# Altium schematic sheet Sheet1.schdoc
size A4
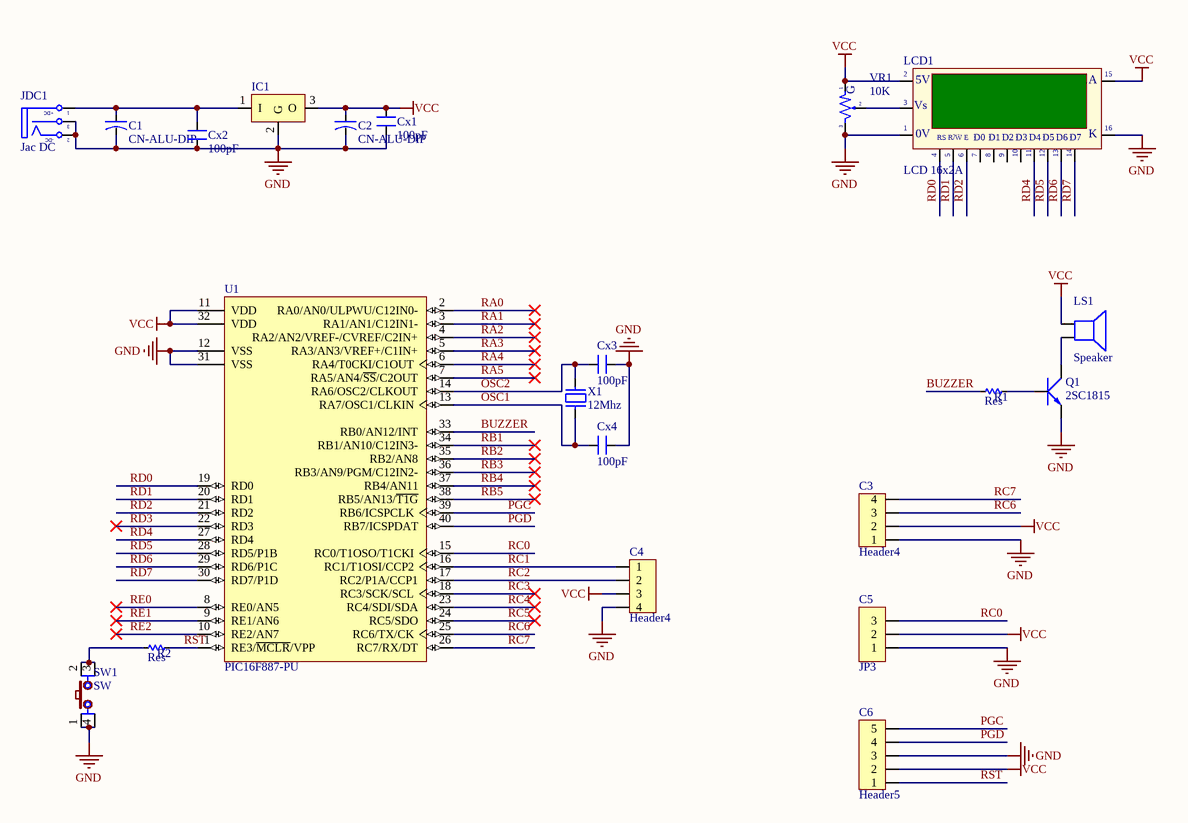
[diagram p0: Sheet1.schdoc]

## Parts
C1  CN-ALU-DIP  [CA-ALU-10BL]
C2  CN-ALU-DIP  [CA-ALU-10BL]
C3  Header4  [Header4]
C4  Header4  [Header4]
C5  JP3  [JP3-D1T]
C6  Header5  [Header5]
Cx1  100pF  [CN1.5]
Cx2  100pF  [CN1.5]
Cx3  100pF  [CN2.5]
Cx4  100pF  [CN2.5]
IC1  LM78xx  [TO220-123]  (value not drawn)
JDC1  Jac DC  [DC0]
LCD1  LCD 16x2A  [LCD16X2N]
LS1  Speaker  [SPEAKER]
Q1  2SC1815  [TO92-123]
R1  Res  [RES-1/4W]
R2  Res  [RES-1/4W]
SW1  SW  [SW2-DIP]
U1  PIC16F887-PU  [DIP40/W0.6]
VR1  10K  [VR-S2]
X1  12Mhz  [XT2]

## Nets
GND: C1.2 C2.2 C3.1 C4.4 C5.1 C6.3 Cx1.2 Cx2.2 Cx3.2 Cx4.2 IC1.2(G) JDC1.2(TN) JDC1.3(S) LCD1.1(GND) LCD1.16(K) Q1.1(E) SW1.1 SW1.4 U1.12(VSS) U1.31(VSS) VR1.3
VCC: C2.1 C3.2 C4.3 C5.2 C6.2 Cx1.1 IC1.3(O) LCD1.2(VDD) LCD1.15(A) LS1.1 U1.11(VDD) U1.32(VDD) VR1.1
BUZZER: R1.2 U1.33(RB0/AN12/INT)
OSC1: Cx4.1 U1.13(RA7/OSC1/CLKIN) X1.1
OSC2: Cx3.1 U1.14(RA6/OSC2/CLKOUT) X1.2
PGC: C6.5 U1.39(RB6/ICSPCLK)
PGD: C6.4 U1.40(RB7/ICSPDAT)
RA0: U1.2(RA0/AN0/ULPWU/C12IN0-)
RA1: U1.3(RA1/AN1/C12IN1-)
RA2: U1.4(RA2/AN2/VREF-/CVREF/C2IN+)
RA3: U1.5(RA3/AN3/VREF+/C1IN+)
RA4: U1.6(RA4/T0CKI/C1OUT)
RA5: U1.7(RA5/AN4/~{SS}/C2OUT)
RB1: U1.34(RB1/AN10/C12IN3-)
RB2: U1.35(RB2/AN8)
RB3: U1.36(RB3/AN9/PGM/C12IN2-)
RB4: U1.37(RB4/AN11)
RB5: U1.38(RB5/AN13/~{T1G})
RC0: C5.3 U1.15(RC0/T1OSO/T1CKI)
RC1: C4.1 U1.16(RC1/T1OSI/CCP2)
RC2: C4.2 U1.17(RC2/P1A/CCP1)
RC3: U1.18(RC3/SCK/SCL)
RC4: U1.23(RC4/SDI/SDA)
RC5: U1.24(RC5/SDO)
RC6: C3.3 U1.25(RC6/TX/CK)
RC7: C3.4 U1.26(RC7/RX/DT)
RD0: LCD1.4(RS) U1.19(RD0)
RD1: LCD1.5(R/~{W}) U1.20(RD1)
RD2: LCD1.6(~{EN}) U1.21(RD2)
RD3: U1.22(RD3)
RD4: LCD1.11(D4) U1.27(RD4)
RD5: LCD1.12(D5) U1.28(RD5/P1B)
RD6: LCD1.13(D6) U1.29(RD6/P1C)
RD7: LCD1.14(D7) U1.30(RD7/P1D)
RE0: U1.8(RE0/AN5)
RE1: U1.9(RE1/AN6)
RE2: U1.10(RE2/AN7)
RST: C6.1 R2.1 U1.1(RE3/~{MCLR}/VPP)
NetC1_1: C1.1 Cx2.1 IC1.1(I) JDC1.1(T)
NetLCD1_3: LCD1.3(VEE) VR1.2
NetLS1_2: LS1.2 Q1.2(C)
NetQ1_3: Q1.3(B) R1.1
NetR2_2: R2.2 SW1.2 SW1.3

Not connected (* = marked no-connect by the designer): LCD1 7(D0) 8(D1) 9(D2) 10(D3)

## Notes on the sheet
- (in symbol DCIN) +DC; -DC
- (in symbol LCD16x2A) 5V; Vs; |; 0V; R/W; E
- (in symbol VR-S) G

## Library data of the parts
C1 C2 = CN-ALU-DIP: Capacitor (Semiconductor SIM Model); Value: 104; LatestRevisionDate: 17-Jul-2002; LatestRevisionNote: Re-released for DXP Platform.; PackageReference: C1206; Publisher: Altium Limited
C3 C4 = Header4: Header IDC, 4 x 1 Pin Vertical 2.54mm Pitch (Non-Boxed, Male); Manufacturer: W¨¹rth Elektronik eiSos GmbH; partNo: 613002143121; ComponentLink1 Description: Manufacturer; ComponentLink2 Description: Datasheet; NoPins: 02; Created Date: 29 March 2013; ComponentLink1URL: http://www.we-online.com; ComponentLink2URL: http://katalog.we-online.de/em/datasheet/6130xx143121.pdf; Created by: Karrer Zheng
C5 = JP3: WR-PHD 2.54 mm Angled Socket Header; Manufacturer: W¨¹rth Elektronik eiSos GmbH; partNo: 613003143121; ComponentLink1 Description: Manufacturer; ComponentLink2 Description: Datasheet; NoPins: 03; Created Date: 29 March 2013; ComponentLink1URL: http://www.we-online.com; ComponentLink2URL: http://katalog.we-online.de/em/datasheet/6130xx143121.pdf; Created by: Karrer Zheng
C6 = Header5: Header IDC, 5 x 1 Pin Vertical 2.54mm Pitch (Non-Boxed, Male); Manufacturer: W¨¹rth Elektronik eiSos GmbH; partNo: 613002143121; ComponentLink1 Description: Manufacturer; ComponentLink2 Description: Datasheet; NoPins: 02; Created Date: 29 March 2013; ComponentLink1URL: http://www.we-online.com; ComponentLink2URL: http://katalog.we-online.de/em/datasheet/6130xx143121.pdf; Created by: Karrer Zheng
Cx1-Cx4 = CN: Value: 33pF
IC1 = LM78xx: Positive Voltage Regulator; Note: Tab is connected to pin 3 (GND).; Published: 24-Aug-2001; LatestRevisionDate: 17-Jul-2002; LatestRevisionNote: Re-released for DXP Platform.; DatasheetVersion: Apr-1994; PackageVersion: Jul-1998; PackageReference: ISOWATT220AB; Publisher: Altium Limited; PackageDescription: TO, Thru-Hole, Vertical, Heatsink Mounted; 3 In-Line Leads; Pitch 2.54 mm; Pin sequence 1, 3, 2; ComponentLink1Description: Manufacturer Link; ComponentLink1URL: http://www.st.com/; ComponentLink2Description: Datasheet; ComponentLink2URL: http://www.st.com/stonline/products/literature/ds/2146/l78m05c.pdf
JDC1 = DCIN: Jac DC input; Value: Jac DC
LCD1 = LCD16x2A: LCD dipslay 16 char, 2 line; Value: LCD16x2A
LS1 = Speaker: Loudspeaker; Published: 24-Mar-1999; LatestRevisionDate: 17-Jul-2002; LatestRevisionNote: Re-released for DXP Platform.; PackageReference: PIN2; Publisher: Altium Limited
Q1 = 2SC1815: NPN 600mW, ECB; Value: C1815
R1 R2 = Res: Manufacturer: Generic Components; Class: Passive; SubClass: R; Published: 08/06/2000; Publisher: Altium Hobart Technology Centre
SW1 = SW4: Switch button 4 pin; Value: Button chip 4 pin
U1 = PIC16F887-PU: Flash-Based, 8-Bit CMOS Microcontroller with nanoWatt Technology, 8K (x14-Bit words) Program Memory, 624 Bytes Data Memory, 35 I/O pins, 40-Pin PDIP, Standard VDD Range, Extended Temperature; Published: 29-Jan-2009; LatestRevisionDate: 02-Dec-2009; LatestRevisionNote: Updated datasheet to version revF, Apr-2009.; DatasheetVersion: revF, Apr-2009; PackageVersion: revBB, Aug-2009; PackageReference: PDIP600-P40; Publisher: Altium Limited; PackageDescription: 40-Lead Plastic Dual In-Line (P) - 600 mil Body [PDIP]; Supplier 1: Digi-Key; Supplier Part Number 1: PIC16F887-E/P-ND; Supplier 2: Farnell; Supplier Part Number 2: 1703423; ComponentLink1Description: Datasheet; ComponentLink1URL: http://ww1.microchip.com/downloads/en/DeviceDoc/41291F.pdf; ComponentLink2Description: Packaging Specification; ComponentLink2URL: http://www.microchip.com/stellent/groups/techpub_sg/documents/packagingspec/en012702.pdf; ComponentLink3Description: Microchip.com Home; ComponentLink3URL: http://www.microchip.com/
VR1 = VR-S: Var Resistor; Value: Volume 50k
X1 = XT2: Crystal, 32.768 KHz, -40 to 85 degC, 3.2 x 1.5 x 0.9 mm SMD; Value: 4Mhz